# EAGLE design si4735-smd (EAGLE 9.6.2)
SI4735-D60-GU Circuit by DM2HR
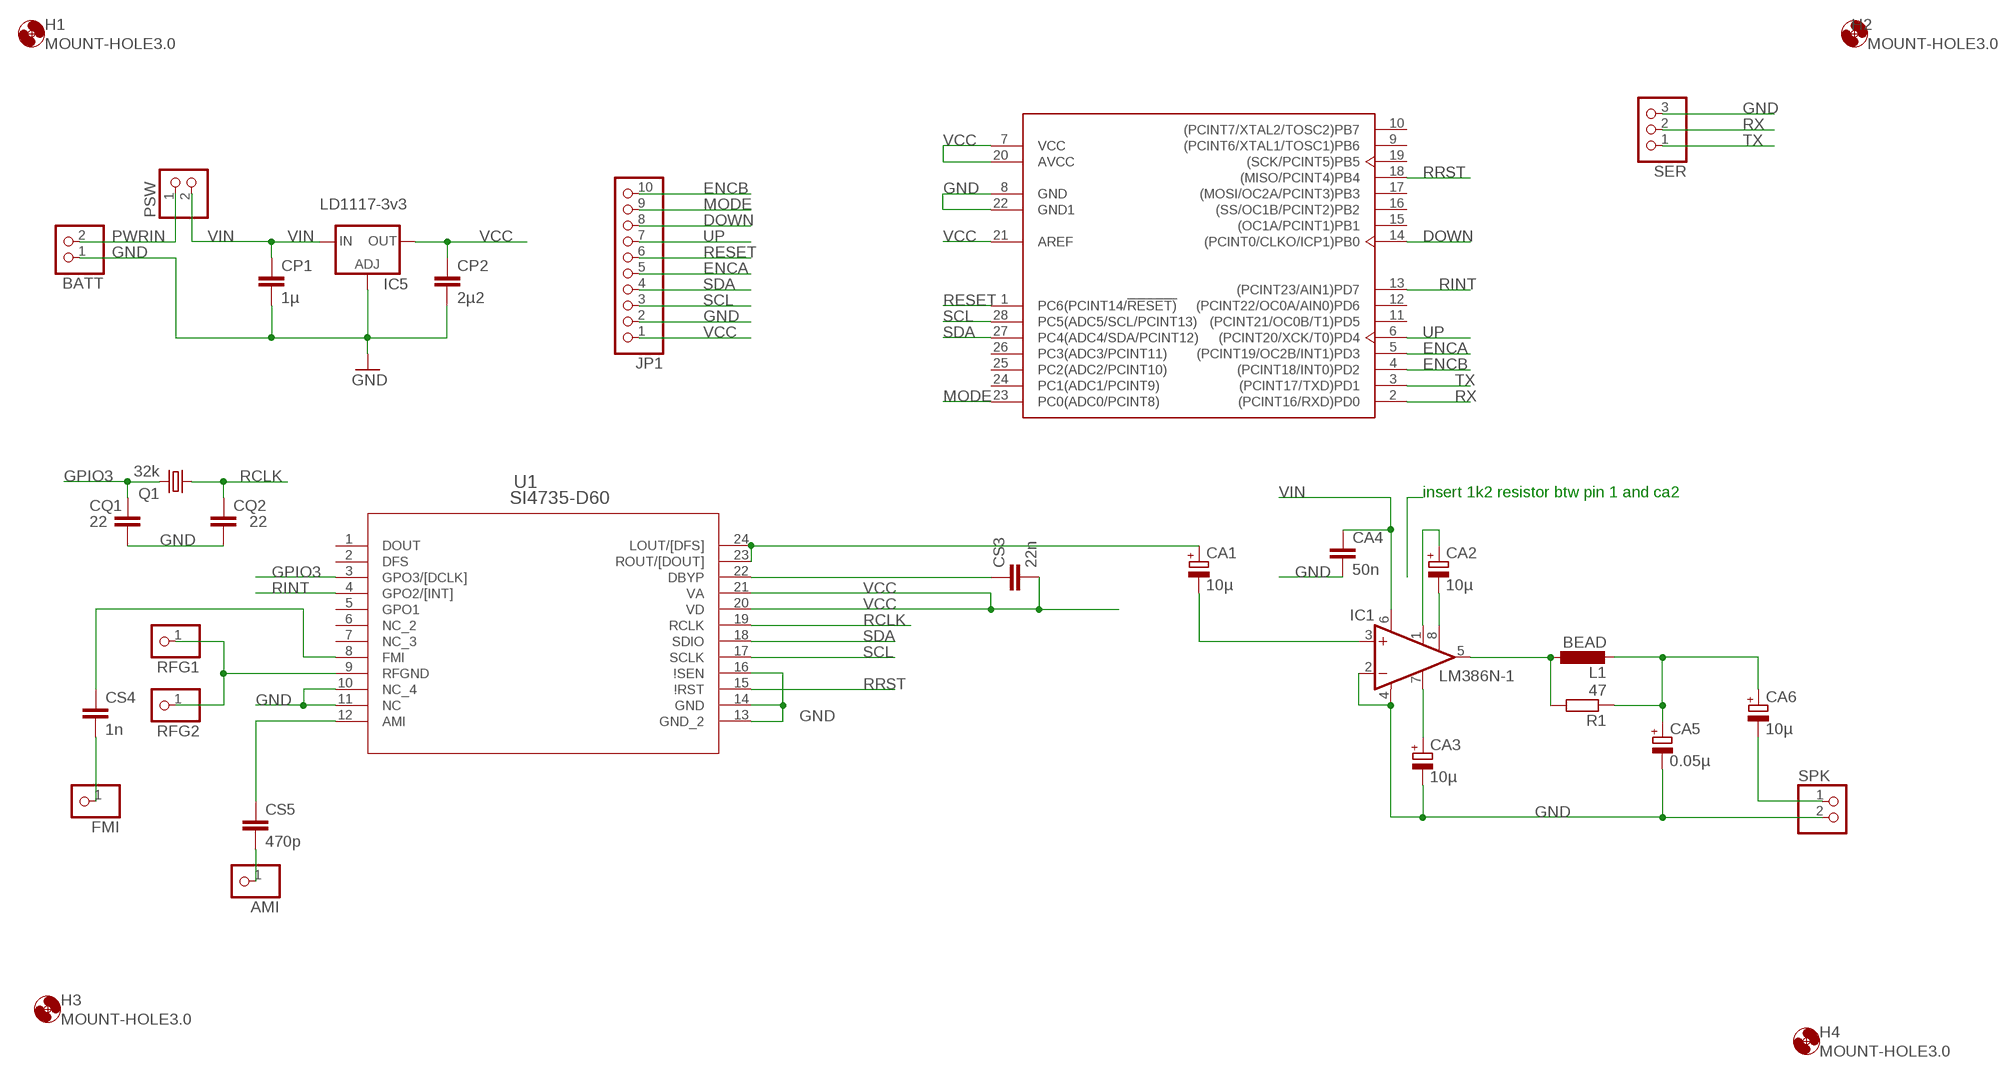
[diagram p0: schematic, sheet 1]

## Parts
AMI  PINHD-1X1  [1X01]
BATT  PINHD-1X2  [1X02]
CA1  10µ  CPOL-EUE2.5-6  [E2,5-6]
CA2  10µ  CPOL-EUE2.5-6  [E2,5-6]
CA3  10µ  CPOL-EUE2.5-6  [E2,5-6]
CA4  50n  C-EUC0805  [C0805]
CA5  0.05µ  CPOL-EUE2.5-6  [E2,5-6]
CA6  10µ  CPOL-EUE2.5-6  [E2,5-6]
CP1  1µ  C-EUC0805  [C0805]
CP2  2µ2  C-EUC0805  [C0805]
CQ1  22  C-EUC0805  [C0805]
CQ2  22  C-EUC0805  [C0805]
CS3  22n  C-EUC0805  [C0805]
CS4  1n  C-EUC0805  [C0805]
CS5  470p  C-EUC0805  [C0805]
FMI  PINHD-1X1  [1X01]
H1  MOUNT-HOLE3.0  [3,0]
H2  MOUNT-HOLE3.0  [3,0]
H3  MOUNT-HOLE3.0  [3,0]
H4  MOUNT-HOLE3.0  [3,0]
IC1  LM386N-1  [DIL08]
IC5  LD1117-3v3  LD117AS50TR  [SOT223]
JP1  PINHD-1X10  [1X10]
L1  BEAD  L-EU0204/7  [0204/7]
PSW  PINHD-1X2  [1X02]
Q1  32k  CRYSTALTC26H  [TC26H]
R1  47  R-EU_M0805  [M0805]
RFG1  PINHD-1X1  [1X01]
RFG2  PINHD-1X1  [1X01]
SER  PINHD-1X3  [1X03]
SPK  PINHD-1X2  [1X02]
U1  SI4735-D60  SI4735-D60-GUSSOP24_SIL-M  [SSOP24_SIL-M]
U3  ATMEGA328P-PU  [DIP-28]

## Nets
DOWN: JP1.8 U3.14((PCINT0/CLKO/ICP1)PB0)
ENCA: JP1.5 U3.5((PCINT19/OC2B/INT1)PD3)
ENCB: JP1.10 U3.4((PCINT18/INT0)PD2)
GND [pwr]: BATT.1 CA3.- CA4.2 CA5.- CP1.2 CP2.2 CQ1.2 CQ2.2 IC1.2(-IN) IC1.4(GND) IC5.1(ADJ) JP1.2 SER.3 SPK.2 U1.10(NC_4) U1.11(NC) U1.13(GND_2) U1.14(GND) U1.16(\!SEN) U3.8(GND) U3.22(GND1)
GPIO3: CQ1.1 Q1.2 U1.3(GPO3/[DCLK])
MODE: JP1.9 U3.23(PC0(ADC0/PCINT8))
N$1: CA1.+ U1.23(ROUT/[DOUT]) U1.24(LOUT/[DFS])
N$2: CA1.- IC1.3(+IN)
N$3: CA2.+ IC1.1(GAIN)
N$4: CA2.- IC1.8(GAIN)
N$5: IC1.5(OUT) L1.1 R1.2
N$6: CA5.+ CA6.+ L1.2 R1.1
N$7: CA6.- SPK.1
N$8: CA3.+ IC1.7(BYPASS)
N$9 [ant]: RFG1.1 RFG2.1 U1.9(RFGND)
N$10 [ant]: CS4.1 U1.8(FMI)
N$12 [ant]: CS4.2 FMI.1
N$13: CS3.1 U1.22(DBYP)
N$14 [ant]: CS5.1 U1.12(AMI)
N$15 [ant]: AMI.1 CS5.2
PWRIN: BATT.2 PSW.1
RCLK: CQ2.1 Q1.1 U1.19(RCLK)
RESET: JP1.6 U3.1(PC6(PCINT14/!RESET))
RINT: U1.4(GPO2/[INT]) U3.13((PCINT23/AIN1)PD7)
RRST: U1.15(\!RST) U3.18((MISO/PCINT4)PB4)
RX: SER.2 U3.2((PCINT16/RXD)PD0)
SCL: JP1.3 U1.17(SCLK) U3.28(PC5(ADC5/SCL/PCINT13))
SDA: JP1.4 U1.18(SDIO) U3.27(PC4(ADC4/SDA/PCINT12))
TX: SER.1 U3.3((PCINT17/TXD)PD1)
UP: JP1.7 U3.6((PCINT20/XCK/T0)PD4)
VCC [pwr]: CP2.1 CS3.2 IC5.4(OUT) JP1.1 U1.20(VD) U1.21(VA) U3.7(VCC) U3.20(AVCC) U3.21(AREF)
VIN [pwr]: CA4.1 CP1.1 IC1.6(VS) IC5.3(IN) PSW.2
Unconnected: U1.1(DOUT) U1.2(DFS) U1.5(GPO1) U1.6(NC_2) U1.7(NC_3) U3.9((PCINT6/XTAL1/TOSC1)PB6) U3.10((PCINT7/XTAL2/TOSC2)PB7) U3.11((PCINT21/OC0B/T1)PD5) U3.12((PCINT22/OC0A/AIN0)PD6) U3.15((OC1A/PCINT1)PB1) U3.16((SS/OC1B/PCINT2)PB2) U3.17((MOSI/OC2A/PCINT3)PB3) U3.19((SCK/PCINT5)PB5) U3.24(PC1(ADC1/PCINT9)) U3.25(PC2(ADC2/PCINT10)) U3.26(PC3(ADC3/PCINT11))

## Notes on the sheet
- insert 1k2 resistor btw pin 1 and ca2

## Library data of the parts
AMI FMI RFG1 RFG2 = pinhead:PINHD-1X1: PIN HEADER
BATT PSW SPK = pinhead:PINHD-1X2: PIN HEADER
CA1-CA3 CA5 CA6 = rcl:CPOL-EU: POLARIZED CAPACITOR, European symbol; SPICEPREFIX: C
CA4 CP1 CP2 CQ1 CQ2 CS3-CS5 = rcl:C-EU: CAPACITOR, European symbol; SPICEPREFIX: C
H1-H4 = holes:MOUNT-HOLE: MOUNTING HOLE with drill center marker
IC1 = linear:LM386?-*: Low Voltage Audio Power Amplifier Source: http://cache.national.com/ds/LM/LM386.pdf
IC5 = v-reg:LD117A?*: Low drop fixed and adjustable positive voltage regulators 1 A Source: http://www.st.com/stonline/products/literature/ds/7194/ld1117axx.pdf
JP1 = pinhead:PINHD-1X10: PIN HEADER
L1 = rcl:L-EU: INDUCTOR, European symbol; SPICEPREFIX: L
Q1 = crystal:CRYSTAL: CRYSTAL; OC_FARNELL: unknown; OC_NEWARK: unknown
R1 = rcl:R-EU_: RESISTOR, European symbol; SPICEPREFIX: R
SER = pinhead:PINHD-1X3: PIN HEADER
U1 = si4735-d60:SI4735-D60-GU
U3 = Microcontroller:ATMEGA328P-PU: IC MCU 8BIT 32KB FLASH 28DIP Manufacturer's datasheet <http://ww1.microchip.com/downloads/en/DeviceDoc/ATmega48A-PA-88A-PA-168A-PA-328-P-DS-DS40002061A.pdf>; CREATED_BY: PCBLayout.com; DIGIKEY_PART_NUMBER: ATMEGA328P-PU-ND; MANUFACTURER: Microchip Technology; MPN: ATMEGA328P-PU; PACKAGE: DIP-28

## Net classes
1 pwr: width 0.5 mm
2 ant: width 0.4 mm

## Board
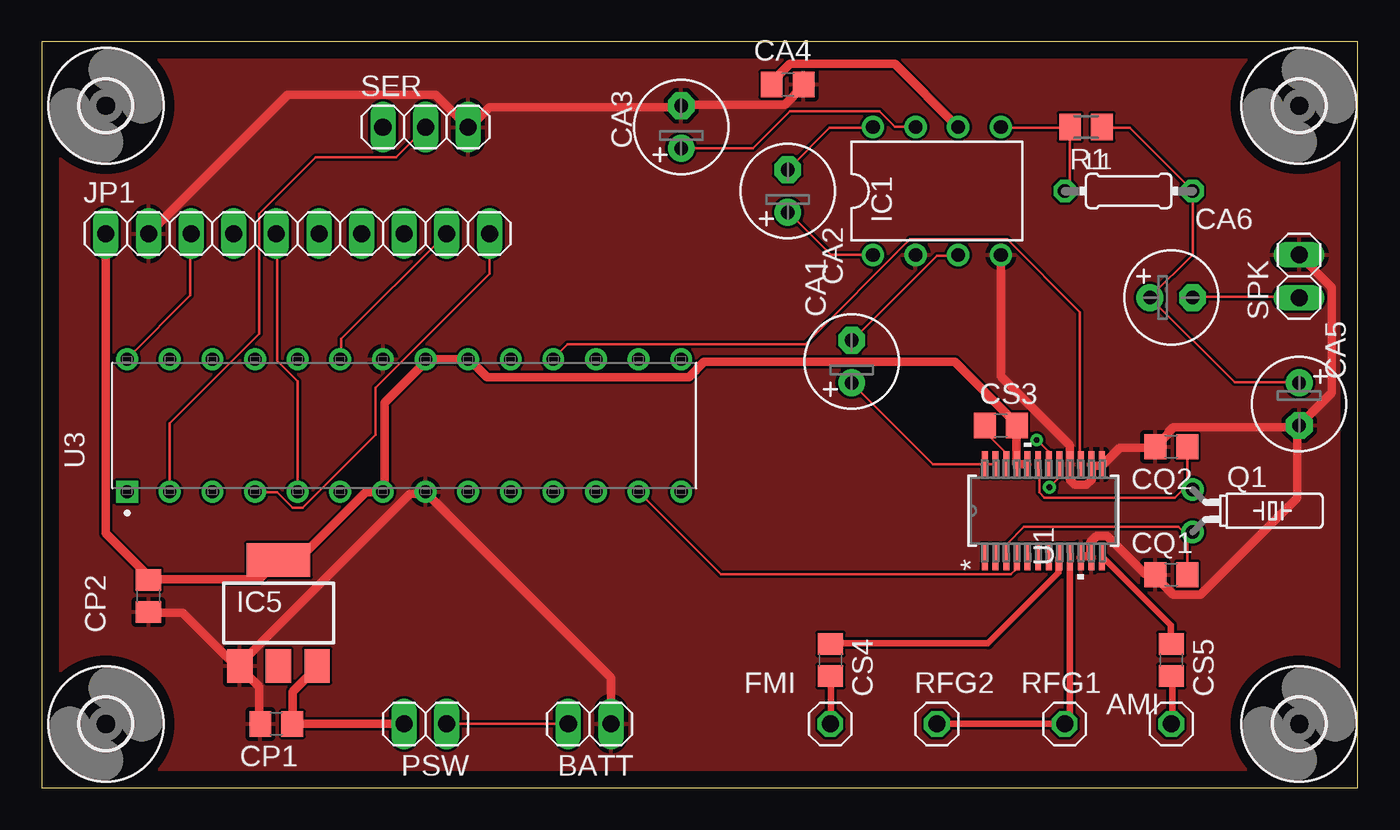
[diagram p1: board, top side]
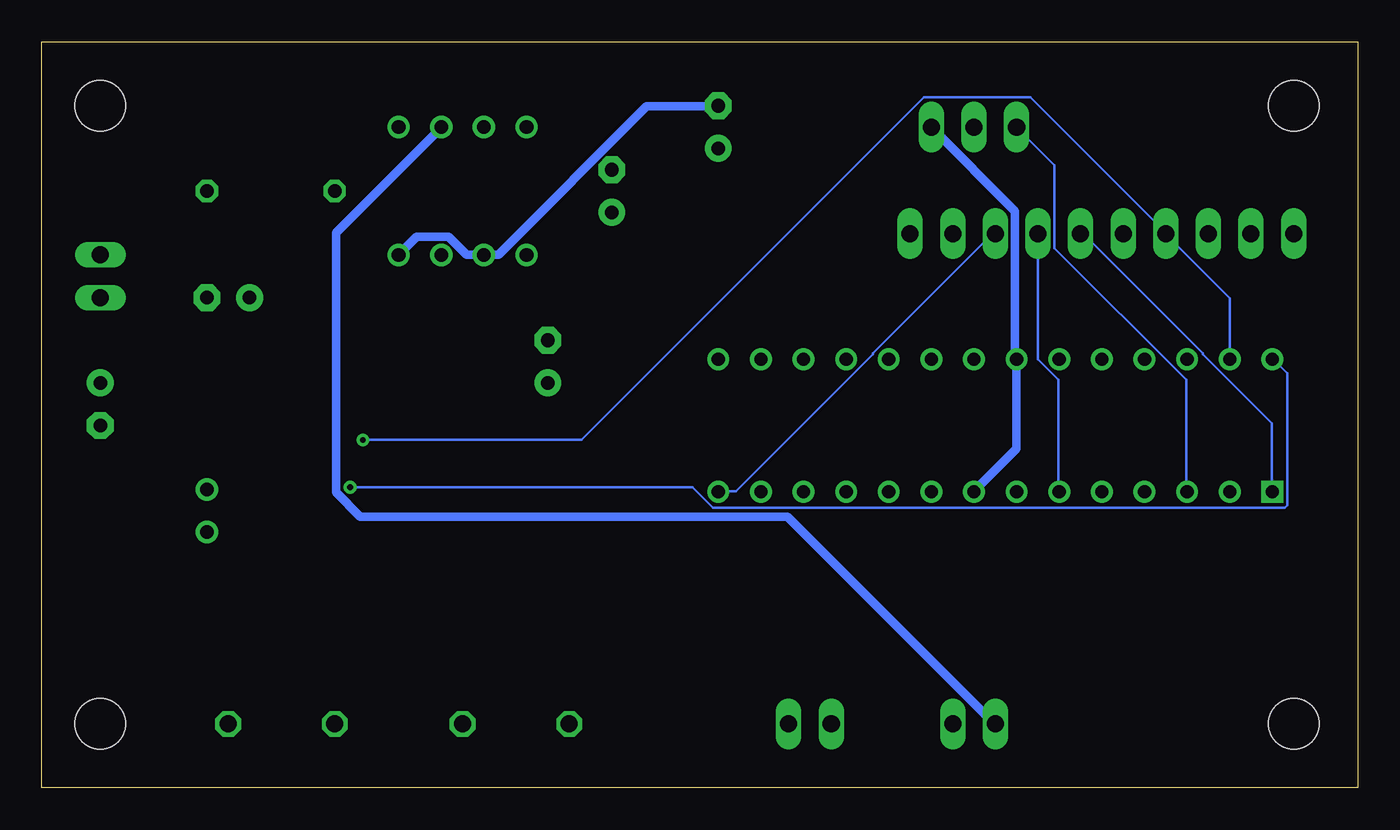
[diagram p2: board, bottom side, seen from below]

Size 78.41 x 44.44 mm. Coordinates in mm from the lower left corner, seen from the top.
Outline: 0,0 78.41,0 78.41,44.44 0,44.44 0,0
Copper layers (1*16): Top 0.035mm / dielectric 1.5mm / Bottom 0.035mm
Design rules "default": minimum track width 6mil, minimum drill 0.35mm, track to track 6mil, track to pad 6mil, pad to pad 6mil, via to via 6mil, smd to smd 6mil, copper to edge 40mil, drill to drill 6mil, minimum pad ring 10mil, minimum via ring 8mil, stop-mask expansion 4mil, vias tented up to drill 0mil, thermal gap 10mil

### Footprints (pad centres in the part's own frame; a part is rotated, then mirrored left to right if it is on the bottom)
1X01 = drill 1.016 octagon: 1 0,0
1X02 = drill 1.016 long: 1 -1.27,0; 2 1.27,0
E2,5-6 = drill 0.813 pad 1.6: + -1.27,0 | drill 0.813 pad 1.6 octagon: - 1.27,0
C0805 = smd 1.3 x 1.5: 1 -0.95,0; 2 0.95,0
3,0 = hole 3: 0,0
DIL08 = drill 0.813 pad 1.27: 1 -3.81,-3.81; 2 -1.27,-3.81; 3 1.27,-3.81; 4 3.81,-3.81; 5 3.81,3.81; 6 1.27,3.81; 7 -1.27,3.81; 8 -3.81,3.81
SOT223 = smd 1.5 x 2: 1 -2.3,-3.15; 2 0,-3.15; 3 2.3,-3.15 | smd 3.8 x 2: 4 0,3.15
1X10 = drill 1.016 long: 1 -11.43,0; 2 -8.89,0; 3 -6.35,0; 4 -3.81,0; 5 -1.27,0; 6 1.27,0; 7 3.81,0; 8 6.35,0; 9 8.89,0; 10 11.43,0
0204/7 = drill 0.813 octagon: 1 -3.81,0; 2 3.81,0
TC26H = drill 0.813: 1 -1.27,0; 2 1.27,0
M0805 = smd 1.3 x 1.6: 1 -0.95,0; 2 0.95,0
1X03 = drill 1.016 long: 1 -2.54,0; 2 0,0; 3 2.54,0
SSOP24_SIL-M = smd 1.6 x 0.356: 1 -2.756,3.493; 2 -2.756,2.857; 3 -2.756,2.223; 4 -2.756,1.587; 5 -2.756,0.953; 6 -2.756,0.318; 7 -2.756,-0.318; 8 -2.756,-0.953; 9 -2.756,-1.587; 10 -2.756,-2.223; 11 -2.756,-2.857; 12 -2.756,-3.493; 13 2.756,-3.493; 14 2.756,-2.857; 15 2.756,-2.223; 16 2.756,-1.587; 17 2.756,-0.953; 18 2.756,-0.318; 19 2.756,0.318; 20 2.756,0.953; 21 2.756,1.587; 22 2.756,2.223; 23 2.756,2.857; 24 2.756,3.493
DIP-28 = drill 0.79 pad 1.19 square: 1 -3.95,16.51 | drill 0.79 pad 1.19: 2 -3.95,13.97; 3 -3.95,11.43; 4 -3.95,8.89; 5 -3.95,6.35; 6 -3.95,3.81; 7 -3.95,1.27; 8 -3.95,-1.27; 9 -3.95,-3.81; 10 -3.95,-6.35; 11 -3.95,-8.89; 12 -3.95,-11.43; 13 -3.95,-13.97; 14 -3.95,-16.51; 15 3.95,-16.51; 16 3.95,-13.97; 17 3.95,-11.43; 18 3.95,-8.89; 19 3.95,-6.35; 20 3.95,-3.81; 21 3.95,-1.27; 22 3.95,1.27; 23 3.95,3.81; 24 3.95,6.35; 25 3.95,8.89; 26 3.95,11.43; 27 3.95,13.97; 28 3.95,16.51

### Placement (x,y rotation side)
AMI  67.31,3.81 0 top
BATT  32.64,3.81 180 top
CA1  48.26,25.4 90 top
CA2  44.45,35.56 90 top
CA3  38.1,39.37 90 top
CA4  44.45,41.91 0 top
CA5  74.93,22.86 270 top
CA6  67.31,29.21 0 top
CP1  13.97,3.81 180 top
CP2  6.35,11.43 270 top
CQ1  67.31,12.7 180 top
CQ2  67.31,20.32 180 top
CS3  57.15,21.59 0 top
CS4  46.99,7.62 270 top
CS5  67.31,7.62 270 top
FMI  46.99,3.81 0 top
H1  74.93,3.81 0 top
H2  74.93,40.64 0 top
H3  3.81,3.81 0 top
H4  3.81,40.64 0 top
IC1  53.34,35.56 0 top
IC5  14.1,10.41 0 top
JP1  15.24,33.02 0 top
L1  64.77,35.56 0 top
PSW  22.86,3.81 180 top
Q1  68.58,16.51 270 top
R1  62.23,39.37 180 top
RFG1  60.96,3.81 0 top
RFG2  53.34,3.81 0 top
SER  22.86,39.37 0 top
SPK  74.93,30.48 90 top
U1  59.69,16.51 90 top
U3  21.59,21.59 90 top

### Tracks (layer width: path | path; a pad name or v marks a point on that pad's centre or on a via)
DOWN
  Bottom 0.152: U3.14 38.1,17.68 37.03,17.68 28.88,25.83 28.88,25.91 21.79,32.99 21.64,32.99 JP1.8
ENCA
  Top 0.152: U3.5 15.24,24.23 14.02,25.45 14.02,32.99 JP1.5
ENCB
  Top 0.152: JP1.10 26.67,30.63 19.89,23.85 19.89,21.03 15.54,16.69 14.94,16.69 14.02,17.6 12.72,17.6 U3.4
GND
  Top 0.5: CP1.2 12.95,3.81 12.95,6.02 11.73,7.24 IC5.1 | CP2.2 6.4,10.44 8.38,10.44 11.51,7.32 IC5.1 | BATT.1 33.91,6.55 22.86,17.6 U3.8 22.63,17.53 21.95,17.53 11.89,7.47 IC5.1 | 62.56,19.2 62.56,18.36 62.26,18.06 61.57,18.06 61.27,18.36 61.27,19.2 U1.16 61.27,19.51 61.27,20.42 57.15,24.54 IC1.4 | 62.56,19.2 U1.14 | 62.56,19.2 62.94,19.2 U1.13 63.25,19.28 64.24,20.27 66.29,20.27 CQ2.2 66.52,20.5 67.13,21.11 67.13,21.18 67.44,21.49 74.6,21.49 CA5.- | 62.48,13.79 62.48,14.63 62.87,15.01 63.48,15.01 65.76,12.72 66.29,12.72 CQ1.2 66.45,12.5 67.44,11.51 69.04,11.51 74.83,17.3 74.83,21.41 CA5.- | 62.48,13.79 U1.11 | 62.48,13.79 61.95,13.79 U1.10 | SPK.2 76.89,29.79 76.89,23.55 CA5.- | CA4.2 45.34,41.91 45.34,41.76 44.27,40.69 38.1,40.69 CA3.- 37.87,40.54 26.67,40.54 25.6,39.47 SER.3 23.47,41.3 14.63,41.3 JP1.2
  Bottom 0.5: U3.8 22.86,17.68 20.34,20.19 20.34,25.53 U3.22 20.42,25.76 20.42,34.37 25.38,39.32 SER.3 | IC1.4 57.15,31.77 56.08,32.84 54.18,32.84 53.11,31.77 52.12,31.77 IC1.2 51.82,31.77 51.21,31.77 42.37,40.62 38.1,40.62 CA3.-
  pour Top: 0,0 78.74,0 78.74,44.45 0,44.45
GPIO3
  Top 0.152: CQ1.1 68.28,12.72 68.28,14.94 Q1.2 68.28,15.01 67.74,15.54 58.52,15.54 57.53,14.55 57.53,13.79 U1.3
MODE
  Top 0.152: U3.23 17.83,25.6 17.83,26.75 24.08,32.99 JP1.9
N$1
  Top 0.152: U1.23 56.77,19.28 56.24,19.28 U1.24 56.16,19.28 53.11,19.28 CA1.+
N$2
  Top 0.152: IC1.3 54.56,31.7 53.34,31.7 48.31,26.67 CA1.-
N$3
  Top 0.152: IC1.1 49.53,31.77 47.02,31.77 44.5,34.29 CA2.+
N$4
  Top 0.152: CA2.- 46.94,39.32 49.53,39.32 IC1.8
N$5
  Top 0.152: L1.1 60.96,35.59 61.27,35.89 61.27,39.32 R1.2 61.19,39.32 57.15,39.32 IC1.5
N$6
  Top 0.152: R1.1 63.25,39.32 64.85,39.32 68.58,35.59 L1.2 68.58,31.77 66.06,29.26 CA6.+ 71.09,24.16 74.91,24.16 CA5.+
N$7
  Top 0.152: SPK.1 74.91,29.26 68.58,29.26 CA6.-
N$8
  Top 0.152: CA3.+ 42.37,38.1 44.58,40.31 49.91,40.31 50.83,39.4 52.05,39.4 IC1.7
N$9
  Top 0.4: U1.9 61.27,13.72 61.27,4.12 RFG1.1 RFG2.1
N$10
  Top 0.4: CS4.1 47.02,8.61 56.39,8.61 60.58,12.8 60.58,13.72 U1.8
N$12
  Top 0.4: CS4.2 47.02,6.63 47.02,3.81 FMI.1
N$13
  Top 0.152: CS3.1 56.24,21.57 56.24,21.18 57.45,19.96 57.45,19.28 U1.22
N$14
  Top 0.4: CS5.1 67.28,8.61 67.28,9.68 63.25,13.72 U1.12
N$15
  Top 0.4: CS5.2 67.36,6.63 67.36,3.81 AMI.1
PWRIN
  Top 0.152: BATT.2 PSW.1
RCLK
  Top 0.152: CQ2.1 68.28,20.27 68.28,18.14 68.58,17.83 Q1.1 68.28,18.06 67.51,17.3 59.74,17.3 59.44,17.6 59.44,19.2 U1.19
RESET
  Bottom 0.152: U3.1 5.11,17.68 5.11,21.72 9.22,25.83 9.22,25.91 16.31,32.99 16.46,32.99 JP1.6
RINT
  Top 0.152: U1.4 58.06,13.72 58.06,13.03 57.76,12.72 40.46,12.72 35.59,17.6 U3.13
RRST
  Top 0.152: U1.15 61.87,19.28 61.87,28.35 57.53,32.69 51.74,32.69 45.49,26.44 31.32,26.44 30.48,25.6 U3.18
RX
  Top 0.152: U3.2 7.62,21.72 12.95,27.05 12.95,34.21 16.31,37.57 21.11,37.57 22.86,39.32 SER.2
SCL  (via drill 0.35)
  Top 0.152: v60.05,17.91 60.58,18.44 60.58,19.2 U1.17 | JP1.3 8.84,32.99 8.84,29.34 5.11,25.6 U3.28
  Bottom 0.152: v60.05,17.91 39.62,17.91 38.41,16.69 4.34,16.69 4.19,16.84 4.19,24.69 5.03,25.53 U3.28
SDA  (via drill 0.35)
  Top 0.152: v59.28,20.73 59.97,20.04 59.97,19.28 U1.18
  Bottom 0.152: v59.28,20.73 46.25,20.73 25.83,41.15 19.51,41.15 11.43,33.07 JP1.4 11.43,32.99 7.62,29.18 U3.27
TX
  Bottom 0.152: SER.1 18.06,37.11 18.06,32.16 10.21,24.31 10.21,17.68 U3.3
UP
  Bottom 0.152: JP1.7 19.05,25.53 17.83,24.31 17.83,17.68 U3.6
VCC
  Top 0.5: IC5.4 12.95,12.42 6.4,12.42 CP2.1 6.33,12.65 3.81,15.16 JP1.1 | IC5.4 | IC5.4 14.33,13.64 15.32,13.64 19.28,17.6 20.27,17.6 U3.7 20.42,17.83 20.42,22.94 22.78,25.3 U3.21 22.86,25.53 25.15,25.53 U3.20 25.45,25.53 26.52,24.46 38.56,24.46 39.47,25.38 54.41,25.38 57.99,21.79 CS3.2 58.06,21.57 58.06,19.28 U1.21 58.37,19.28 58.67,19.28 U1.20
VIN
  Top 0.5: IC5.3 16.46,7.24 14.94,5.71 14.94,3.81 CP1.1 PSW.2 | CA4.1 43.51,42.06 44.58,43.13 50.83,43.13 54.56,39.4 IC1.6
  Bottom 0.5: PSW.2 21.64,3.81 33.98,16.15 59.44,16.15 60.88,17.6 60.88,33.07 54.63,39.32 IC1.6